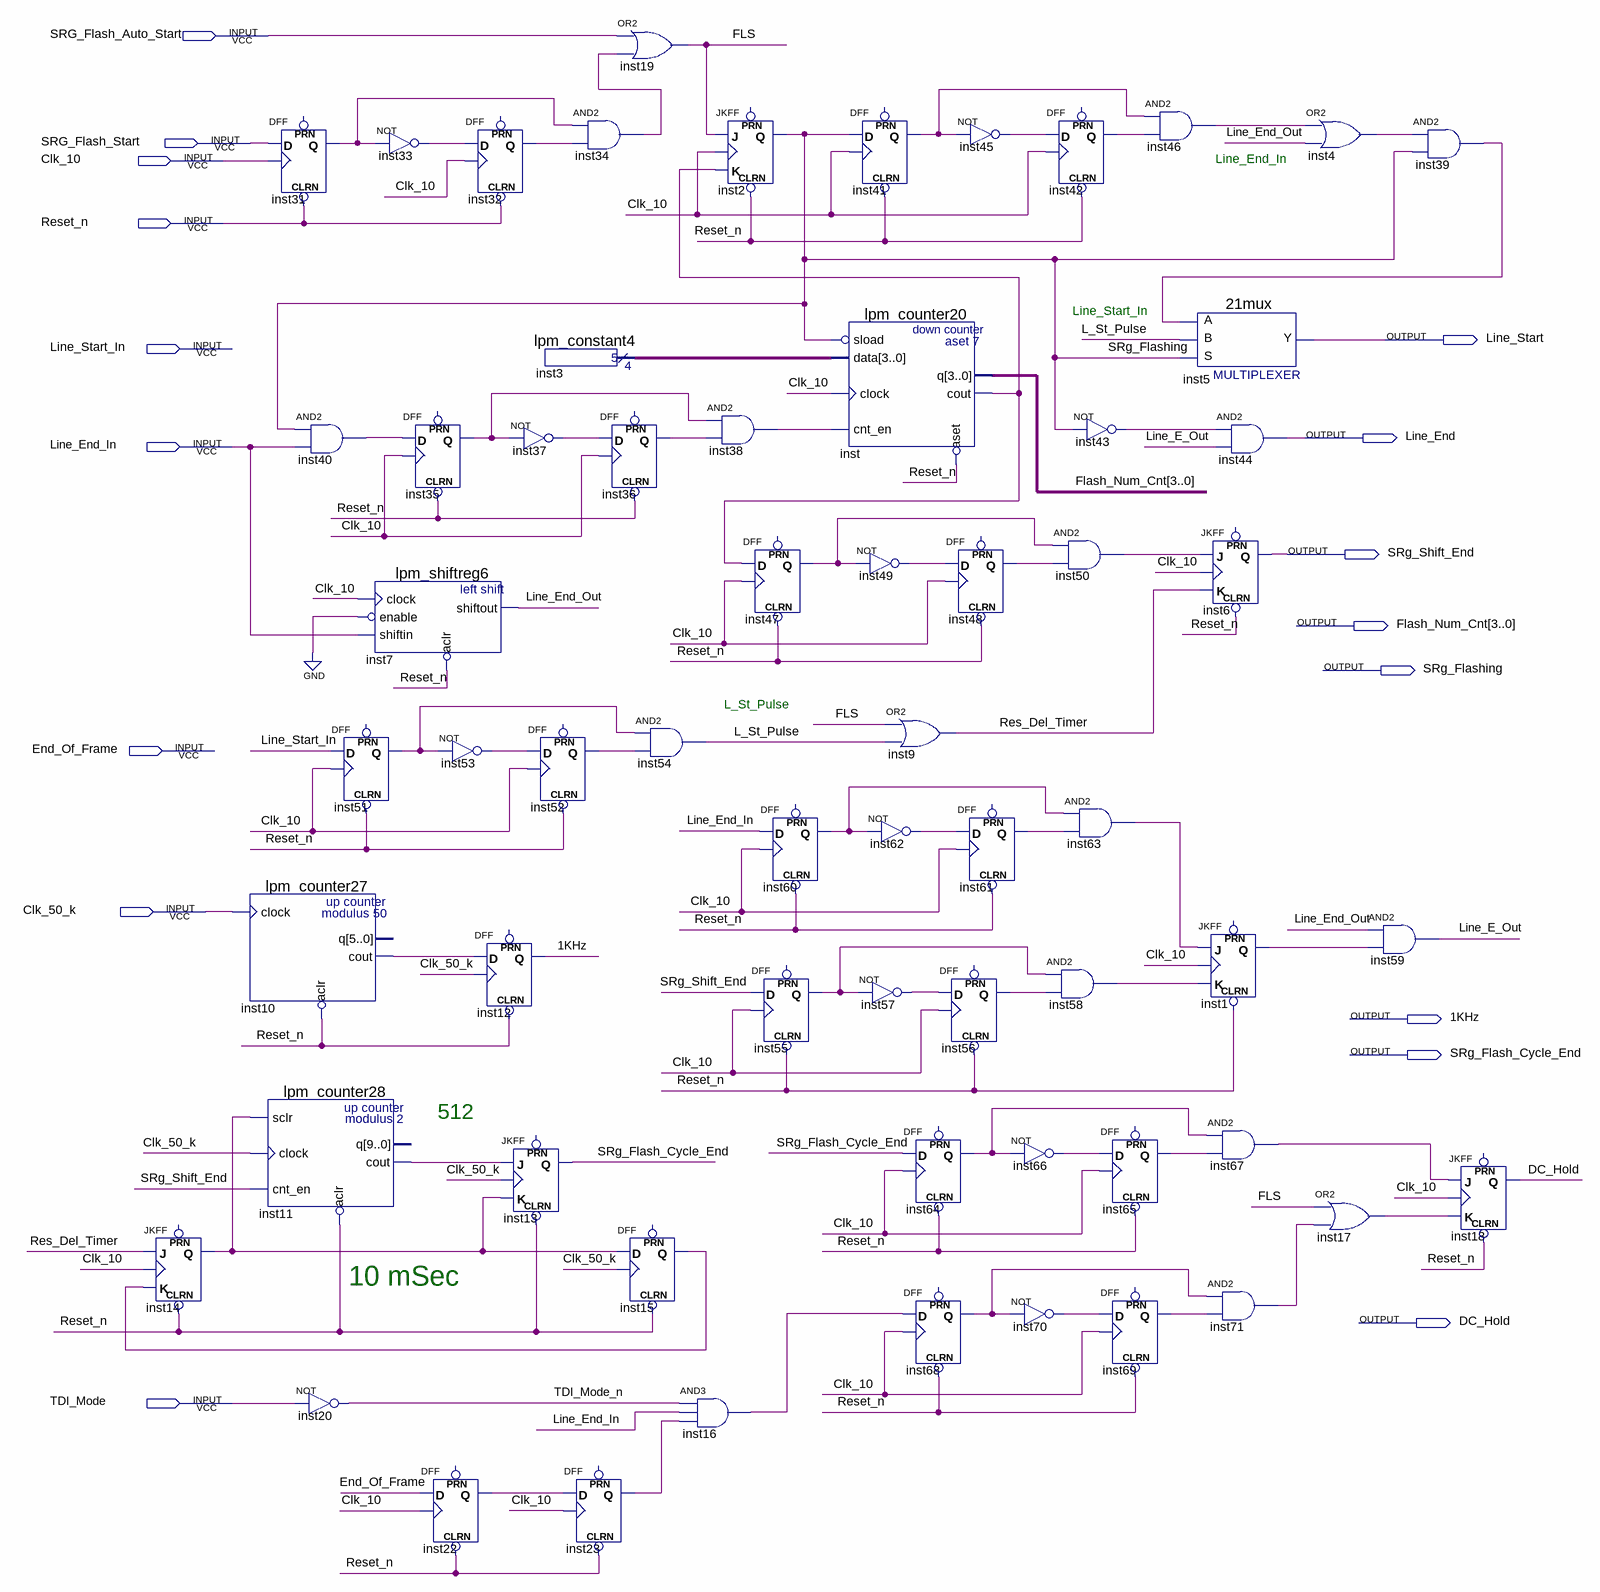
[diagram p0: schematic sheet]
// Quartus schematic SRG_Flashing_Module.bdf as structural Verilog: 63 symbols, 17 pins
module SRG_Flashing_Module (
  input  SRG_Flash_Auto_Start,
  input  SRG_Flash_Start,
  input  Clk_10,
  input  Reset_n,
  input  Line_Start_In,
  input  Line_End_In,
  input  End_Of_Frame,
  input  Clk_50_k,
  input  TDI_Mode,
  output Line_Start,
  output Line_End,
  output SRg_Shift_End,
  output [3:0] Flash_Num_Cnt,
  output SRg_Flashing,
  output \1KHz ,
  output SRg_Flash_Cycle_End,
  output DC_Hold
);

  wire FLS, inst1_q, inst4_out, inst10_cout, inst11_cout, inst14_q, inst15_q, inst16_out, inst17_out,
       inst22_q, inst23_q, inst31_q, inst32_q, inst33_out, inst34_out, inst35_q, inst36_q, inst37_out,
       inst38_out, inst39_out, inst40_out, inst41_q, inst42_q, inst43_out, inst45_out, inst46_out, inst47_q,
       inst48_q, inst49_out, inst50_out, inst51_q, inst52_q, inst53_out, inst55_q, inst56_q, inst57_out,
       inst58_out, inst60_q, inst61_q, inst62_out, inst63_out, inst64_q, inst65_q, inst66_out, inst67_out,
       inst68_q, inst69_q, inst70_out, inst71_out, inst_cout, L_St_Pulse, Line_E_Out, Line_End_Out,
       Res_Del_Timer, TDI_Mode_n;
  wire [3:0] inst3_result;

  JKFF inst14 (.CLRN(Reset_n), .K(inst15_q), .J(Res_Del_Timer), .CLK(Clk_10), .Q(inst14_q));  // open: PRN
  lpm_counter27 inst10 (.clock(Clk_50_k), .aclr(~Reset_n), .cout(inst10_cout));  // open: q
  DFF inst31 (.CLRN(Reset_n), .CLK(Clk_10), .D(SRG_Flash_Start), .Q(inst31_q));  // open: PRN
  and inst40 (inst40_out, SRg_Flashing, Line_End_In);
  lpm_counter28 inst11 (
    .sclr(inst14_q), .clock(Clk_50_k), .cnt_en(SRg_Shift_End), .aclr(~Reset_n), .cout(inst11_cout));  // open: q
  not inst20 (TDI_Mode_n, TDI_Mode);
  not inst33 (inst33_out, inst31_q);
  lpm_shiftreg6 inst7 (.clock(Clk_10), .enable(~1'b0), .shiftin(Line_End_In), .aclr(~Reset_n), .shiftout(Line_End_Out));
  DFF inst51 (.CLRN(Reset_n), .CLK(Clk_10), .D(Line_Start_In), .Q(inst51_q));  // open: PRN
  DFF inst35 (.CLRN(Reset_n), .CLK(Clk_10), .D(inst40_out), .Q(inst35_q));  // open: PRN
  not inst53 (inst53_out, inst51_q);
  DFF inst22 (.CLRN(Reset_n), .CLK(Clk_10), .D(End_Of_Frame), .Q(inst22_q));  // open: PRN
  DFF inst32 (.CLRN(Reset_n), .CLK(Clk_10), .D(inst33_out), .Q(inst32_q));  // open: PRN
  not inst37 (inst37_out, inst35_q);
  DFF inst12 (.CLRN(Reset_n), .CLK(Clk_50_k), .D(inst10_cout), .Q(\1KHz ));  // open: PRN
  JKFF inst13 (.CLRN(Reset_n), .K(inst14_q), .J(inst11_cout), .CLK(Clk_50_k), .Q(SRg_Flash_Cycle_End));  // open: PRN
  and inst34 (inst34_out, inst31_q, inst32_q);
  lpm_constant4 inst3 (.result(inst3_result));
  DFF inst52 (.CLRN(Reset_n), .CLK(Clk_10), .D(inst53_out), .Q(inst52_q));  // open: PRN
  DFF inst23 (.CLRN(Reset_n), .CLK(Clk_10), .D(inst22_q), .Q(inst23_q));  // open: PRN
  or inst19 (FLS, SRG_Flash_Auto_Start, inst34_out);
  DFF inst36 (.CLRN(Reset_n), .CLK(Clk_10), .D(inst37_out), .Q(inst36_q));  // open: PRN
  and inst54 (L_St_Pulse, inst51_q, inst52_q);
  DFF inst15 (.CLRN(Reset_n), .CLK(Clk_50_k), .D(inst14_q), .Q(inst15_q));  // open: PRN
  JKFF inst2 (.CLRN(Reset_n), .K(inst_cout), .J(FLS), .CLK(Clk_10), .Q(SRg_Flashing));  // open: PRN
  and inst38 (inst38_out, inst35_q, inst36_q);
  and inst16 (inst16_out, TDI_Mode_n, Line_End_In, inst23_q);
  DFF inst47 (.CLRN(Reset_n), .CLK(Clk_10), .D(inst_cout), .Q(inst47_q));  // open: PRN
  DFF inst60 (.CLRN(Reset_n), .CLK(Clk_10), .D(Line_End_In), .Q(inst60_q));  // open: PRN
  DFF inst55 (.CLRN(Reset_n), .CLK(Clk_10), .D(SRg_Shift_End), .Q(inst55_q));  // open: PRN
  DFF inst41 (.CLRN(Reset_n), .CLK(Clk_10), .D(SRg_Flashing), .Q(inst41_q));  // open: PRN
  lpm_counter20 inst (
    .sload(~SRg_Flashing), .data(inst3_result), .clock(Clk_10), .cnt_en(inst38_out), .aset(~Reset_n),
    .q(Flash_Num_Cnt), .cout(inst_cout));
  not inst49 (inst49_out, inst47_q);
  not inst62 (inst62_out, inst60_q);
  not inst57 (inst57_out, inst55_q);
  DFF inst48 (.CLRN(Reset_n), .CLK(Clk_10), .D(inst49_out), .Q(inst48_q));  // open: PRN
  or inst9 (Res_Del_Timer, FLS, L_St_Pulse);
  DFF inst56 (.CLRN(Reset_n), .CLK(Clk_10), .D(inst57_out), .Q(inst56_q));  // open: PRN
  DFF inst64 (.CLRN(Reset_n), .CLK(Clk_10), .D(SRg_Flash_Cycle_End), .Q(inst64_q));  // open: PRN
  DFF inst68 (.CLRN(Reset_n), .CLK(Clk_10), .D(inst16_out), .Q(inst68_q));  // open: PRN
  not inst45 (inst45_out, inst41_q);
  DFF inst61 (.CLRN(Reset_n), .CLK(Clk_10), .D(inst62_out), .Q(inst61_q));  // open: PRN
  not inst66 (inst66_out, inst64_q);
  not inst70 (inst70_out, inst68_q);
  DFF inst42 (.CLRN(Reset_n), .CLK(Clk_10), .D(inst45_out), .Q(inst42_q));  // open: PRN
  not inst43 (inst43_out, SRg_Flashing);
  and inst50 (inst50_out, inst47_q, inst48_q);
  and inst63 (inst63_out, inst60_q, inst61_q);
  and inst58 (inst58_out, inst55_q, inst56_q);
  and inst46 (inst46_out, inst41_q, inst42_q);
  DFF inst65 (.CLRN(Reset_n), .CLK(Clk_10), .D(inst66_out), .Q(inst65_q));  // open: PRN
  DFF inst69 (.CLRN(Reset_n), .CLK(Clk_10), .D(inst70_out), .Q(inst69_q));  // open: PRN
  \21mux  inst5 (.S(SRg_Flashing), .B(L_St_Pulse), .A(inst39_out), .Y(Line_Start));
  and inst44 (Line_End, inst43_out, Line_E_Out);
  JKFF inst6 (.CLRN(Reset_n), .K(Res_Del_Timer), .J(inst50_out), .CLK(Clk_10), .Q(SRg_Shift_End));  // open: PRN
  JKFF inst1 (.CLRN(Reset_n), .K(inst58_out), .J(inst63_out), .CLK(Clk_10), .Q(inst1_q));  // open: PRN
  and inst67 (inst67_out, inst64_q, inst65_q);
  and inst71 (inst71_out, inst68_q, inst69_q);
  or inst4 (inst4_out, inst46_out, Line_End_Out);
  and inst59 (Line_E_Out, Line_End_Out, inst1_q);
  or inst17 (inst17_out, FLS, inst71_out);
  and inst39 (inst39_out, inst4_out, SRg_Flashing);
  JKFF inst18 (.CLRN(Reset_n), .K(inst17_out), .J(inst67_out), .CLK(Clk_10), .Q(DC_Hold));  // open: PRN

  // Notes on the sheet:
  //   Line_End_In
  //   Line_Start_In
  //   L_St_Pulse
  //   512
  //   10 mSec
endmodule
